# EAGLE design MagusExpander (EAGLE 9.2.1)
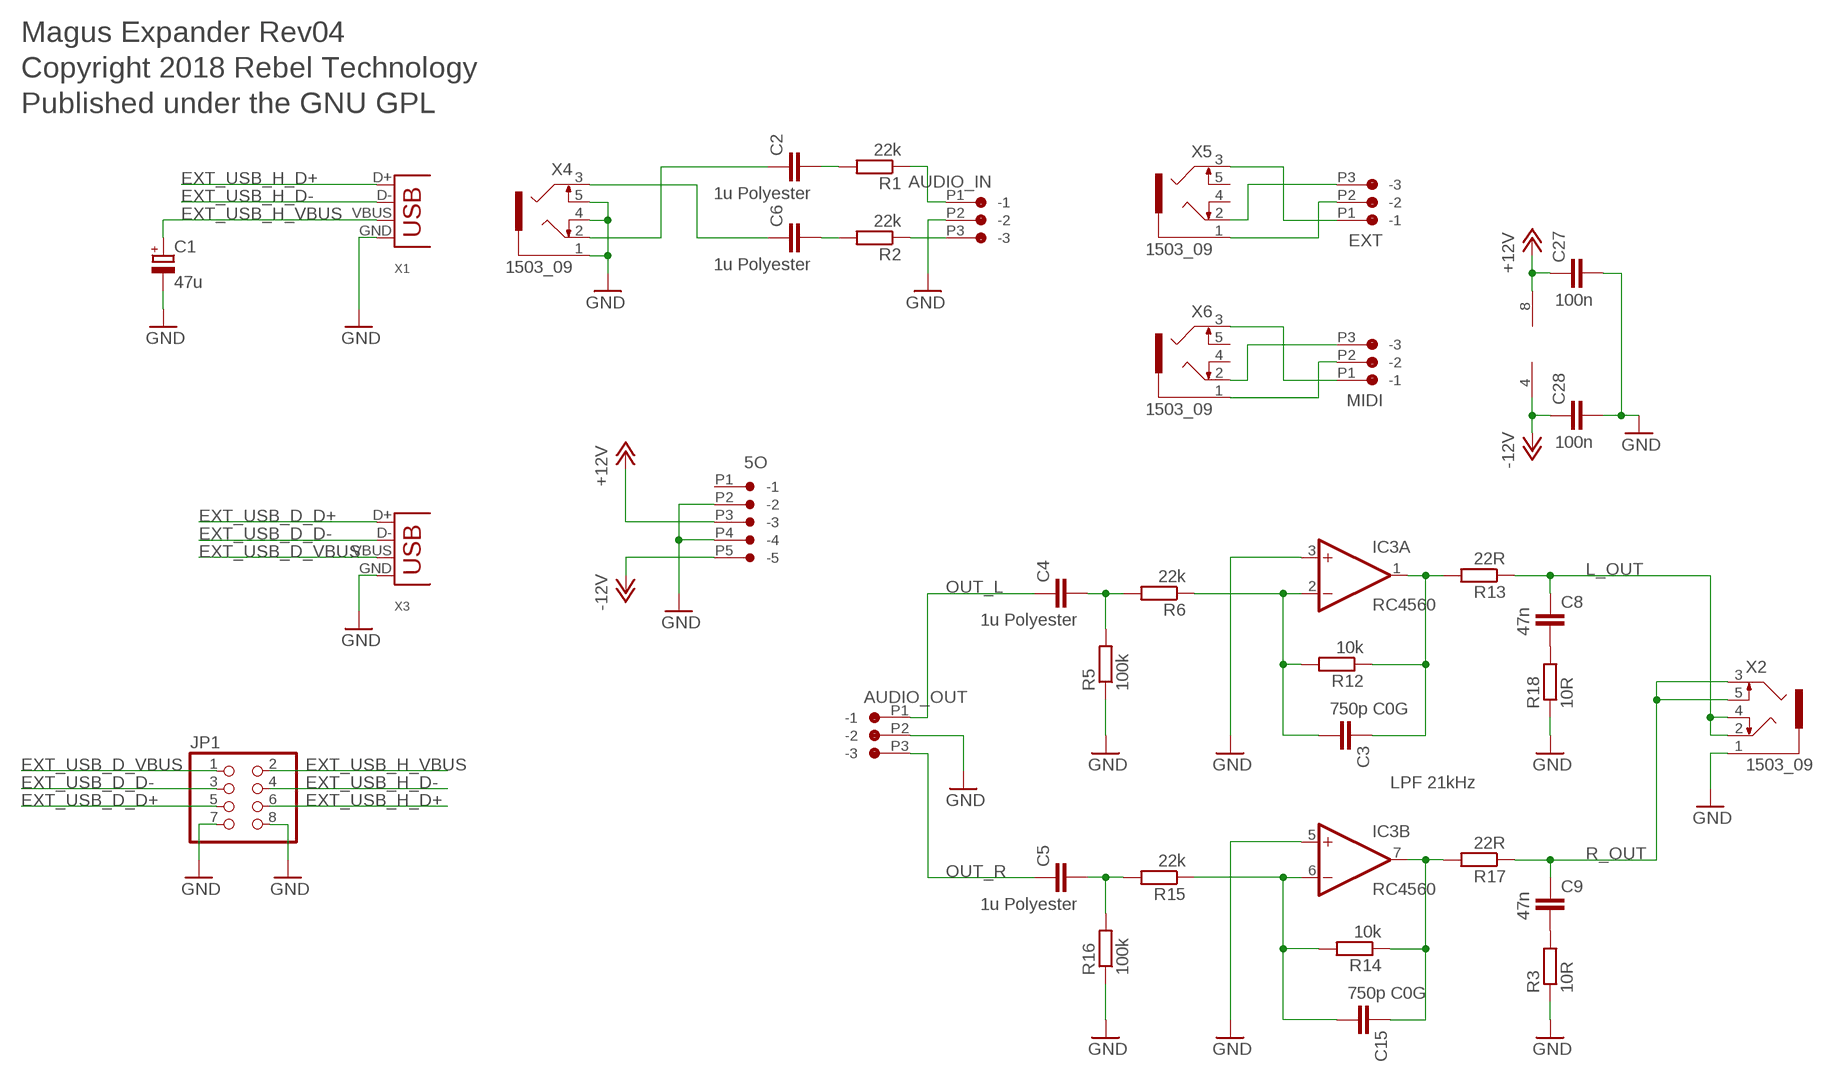
[diagram p0: schematic, sheet 1]

## Parts
5O  CON-JST_PH_5W  [CON-JST_PH_5W]
AUDIO_IN  CON-JST_PH_3W  [CON-JST_PH_3W]
AUDIO_OUT  CON-JST_PH_3W  [CON-JST_PH_3W]
C1  47u  CPOL-EU153CLV-0505  [CPOL-5]
C2  1u Polyester  C-EUC1210  [C1210]
C3  750p C0G  C-EUC0603  [C0603]
C4  1u Polyester  C-EUC1210  [C1210]
C5  1u Polyester  C-EUC1210  [C1210]
C6  1u Polyester  C-EUC1210  [C1210]
C8  47n  C-EUC0603  [C0603]
C9  47n  C-EUC0603  [C0603]
C15  750p C0G  C-EUC0603  [C0603]
C27  100n  C-EUC0603  [C0603]
C28  100n  C-EUC0603  [C0603]
EXT  CON-JST_PH_3W  [CON-JST_PH_3W]
IC3  RC4560  NE5532D  [SO08]
JP1  PINHD-2X4  [2X04]
MIDI  CON-JST_PH_3W  [CON-JST_PH_3W]
R1  22k  R-EU_R0603  [R0603]
R2  22k  R-EU_R0603  [R0603]
R3  10R  R-EU_R0603  [R0603]
R5  100k  R-EU_R0603  [R0603]
R6  22k  R-EU_R0603  [R0603]
R12  10k  R-EU_R0603  [R0603]
R13  22R  R-EU_R0603  [R0603]
R14  10k  R-EU_R0603  [R0603]
R15  22k  R-EU_R0603  [R0603]
R16  100k  R-EU_R0603  [R0603]
R17  22R  R-EU_R0603  [R0603]
R18  10R  R-EU_R0603  [R0603]
X1  USB-A-H  [USB-A-H]
X2  1503_09  [1503_09]
X3  USB-B-H  [USB-B-H]
X4  1503_09  [1503_09]
X5  1503_09  [1503_09]
X6  1503_09  [1503_09]

## Nets
+12V: 5O.P3(-3) C27.1 IC3.8(P:V+)
-12V: 5O.P5(-5) C28.1 IC3.4(P:V-)
EXT_USB_D_D+: JP1.5 X3.D+
EXT_USB_D_D-: JP1.3 X3.D-
EXT_USB_D_VBUS: JP1.1 X3.VBUS
EXT_USB_H_D+: JP1.6 X1.D+
EXT_USB_H_D-: JP1.4 X1.D-
EXT_USB_H_VBUS: C1.+ JP1.2 X1.VBUS
GND: 5O.P2(-2) 5O.P4(-4) AUDIO_IN.P2(-2) AUDIO_OUT.P2(-2) C1.- C27.2 C28.2 IC3.3(A:+IN) IC3.5(B:+IN) JP1.7 JP1.8 R3.1 R5.1 R16.1 R18.1 X1.GND X2.1 X3.GND X4.1 X4.4 X4.5
L_OUT: C8.1 R13.1 X2.2 X2.4
N$1: C15.2 IC3.6(B:-IN) R14.2 R15.1
N$2: C15.1 IC3.7(B:OUT) R14.1 R17.2
N$3: C3.2 IC3.2(A:-IN) R6.1 R12.2
N$4: C5.2 R15.2 R16.2
N$5: AUDIO_IN.P3(-3) R2.1
N$6: AUDIO_IN.P1(-1) R1.1
N$7: MIDI.P1(-1) X6.3
N$8: C4.2 R5.2 R6.2
N$9: C2.1 X4.2
N$10: MIDI.P3(-3) X6.2
N$11: EXT.P1(-1) X5.3
N$12: C9.2 R3.2
N$13: MIDI.P2(-2) X6.1
N$14: EXT.P3(-3) X5.2
N$15: EXT.P2(-2) X5.1
N$17: C6.1 X4.3
N$18: C6.2 R2.2
N$19: C3.1 IC3.1(A:OUT) R12.1 R13.2
N$20: C2.2 R1.2
N$21: C8.2 R18.2
OUT_L: AUDIO_OUT.P1(-1) C4.1
OUT_R: AUDIO_OUT.P3(-3) C5.1
R_OUT: C9.1 R17.1 X2.3 X2.5
Unconnected: 5O.P1(-1) X5.4 X5.5 X6.4 X6.5

## Notes on the sheet
- Magus Expander Rev04
- Copyright 2018 Rebel Technology
- Published under the GNU GPL
- LPF 21kHz

## Library data of the parts
5O = Rebel:CON-JST_PH_5W
AUDIO_IN AUDIO_OUT EXT MIDI = Rebel:CON-JST_PH_3W
C1 = Rebel:CPOL-EU: POLARIZED CAPACITOR, European symbol
C2-C6 C8 C9 C15 C27 C28 = Rebel:C-EU: CAPACITOR, European symbol
IC3 = linear:NE5532: AUDIO AMPLIFIER
JP1 = pinhead:PINHD-2X4: PIN HEADER
R1-R3 R5 R6 R12-R18 = resistor:R-EU_: RESISTOR, European symbol
X1 X3 = con-usb-3:USB: USB Connectors
X2 X4-X6 = con-lumberg:1503_09: Jack connectors according to JISC 6560, 3.5 mm Klinkeneinbaukupplung nach JISC 6560, 3,5 mm, 3-polig/ stereo, abgewinkelte Ausführung, mit 2 Öffnern und Lötaugen, für Leiterplatten Rückseitenmontage Source: http://www.lumberg.com/Produkte/PDFs/1503_09.pdf; OC_FARNELL: 1243244; OC_NEWARK: unknown

## Net classes
1 power: width 0.178 mm, drill 0.305 mm, clearance 0.178 mm to class 0, clearance 0.178 mm

## Board
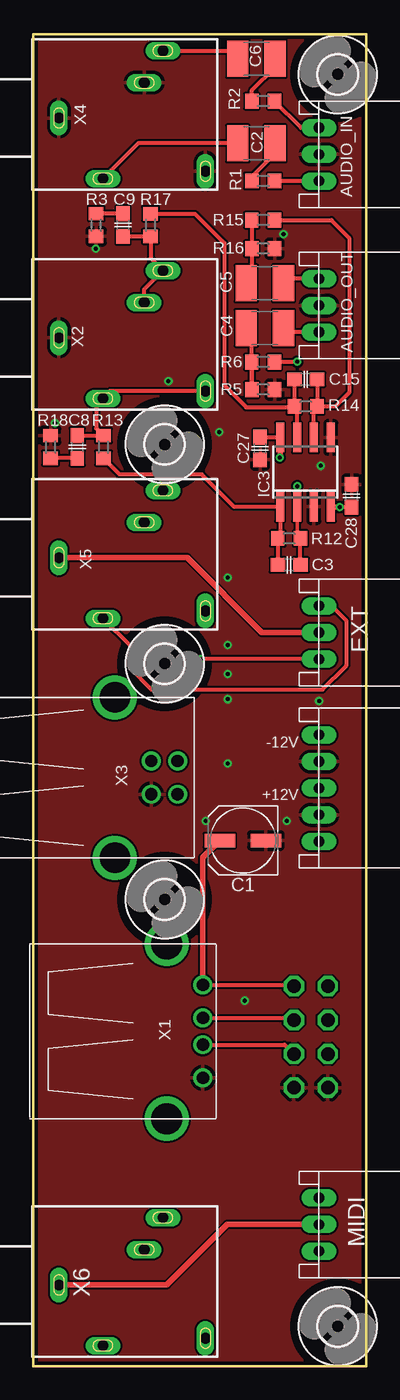
[diagram p1: board, top side]
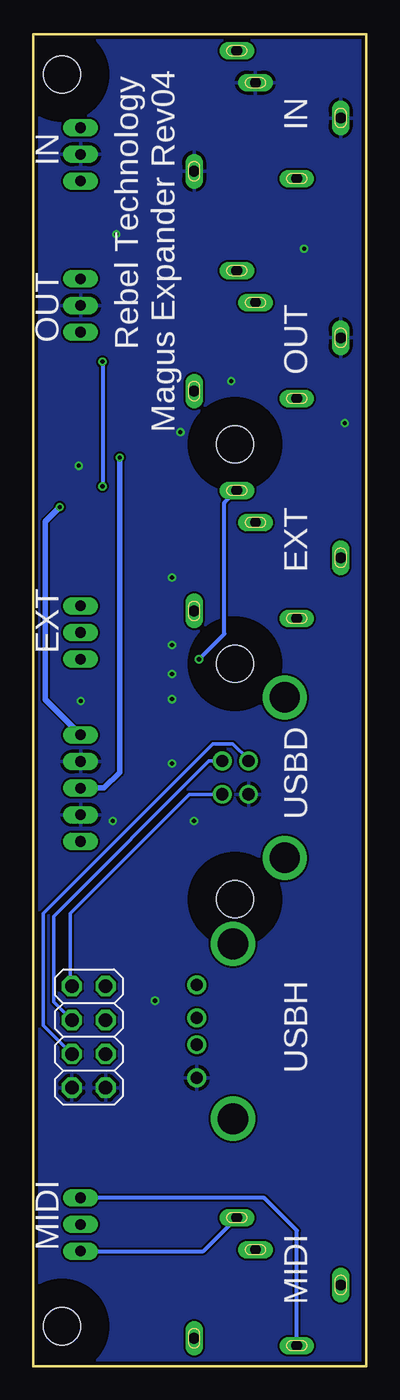
[diagram p2: board, bottom side, seen from below]

Size 25 x 100 mm. Coordinates in mm from the lower left corner, seen from the top.
Outline: 25,100 25,0 0,0 0,100 25,100
Copper layers (1*16): Top 0.035mm / dielectric 1.5mm / Bottom 0.035mm
Design rules "SeeedStudio_2layer_DRU_no_angle_20140221": minimum track width 6mil, minimum drill 12mil, track to track 6mil, track to pad 6mil, pad to pad 6mil, via to via 6mil, smd to smd 0mil, copper to edge 10mil, drill to drill 10mil, minimum pad ring 10mil, minimum via ring 6mil, stop-mask expansion 2mil, vias tented up to drill 100mil, thermal gap 10mil

### Footprints (pad centres in the part's own frame; a part is rotated, then mirrored left to right if it is on the bottom)
CON-JST_PH_5W = drill 0.8 long: P1 0,0; P2 -2,0; P3 -4,0; P4 -6,0; P5 -8,0
CON-JST_PH_3W = drill 0.8 long: P1 0,0; P2 -2,0; P3 -4,0
CPOL-5 = smd 2.3 x 1: + 1.725,0; - -1.725,0
C1210 = smd 1.6 x 2.7: 1 -1.4,0; 2 1.4,0
C0603 = smd 1.1 x 1: 1 -0.85,0; 2 0.85,0
SO08 = smd 0.6 x 2.2: 1 -1.905,-2.6; 2 -0.635,-2.6; 3 0.635,-2.6; 4 1.905,-2.6; 5 1.905,2.6; 6 0.635,2.6; 7 -0.635,2.6; 8 -1.905,2.6
2X04 = drill 1.016 octagon: 1 -3.81,-1.27; 2 -3.81,1.27; 3 -1.27,-1.27; 4 -1.27,1.27; 5 1.27,-1.27; 6 1.27,1.27; 7 3.81,-1.27; 8 3.81,1.27
R0603 = smd 1 x 1.1: 1 -0.85,0; 2 0.85,0
2,8 = hole 2.8: 0,0
USB-A-H = drill 0.914: D+ 2.718,-1.003; D- 2.718,1.003; GND 2.718,-3.493; VBUS 2.718,3.493 | drill 2.311: P$5 0,-6.566; P$6 0,6.566
1503_09 = drill 0.8 pad 1.2 long: 1 0,-2.1; 2 -4.55,-5.4; 3 5.05,-9.9; 4 -4,-13.1; 5 2.65,-8.5
USB-B-H = drill 0.914: D+ 0,1.25; D- 1.981,1.25; GND 0,-1.25; VBUS 1.981,-1.25 | drill 2.286: P$1 -2.718,-6.02; P$2 -2.718,6.02

### Placement (x,y rotation side)
5O  21.45,39.41 270 top
AUDIO_IN  21.45,89 270 top
AUDIO_OUT  21.45,77.65 270 top
C1  15.73,39.47 180 top
C2  16.75,91.83 0 top
C3  19.21,60.17 0 top
C4  17.38,77.95 180 top
C5  17.38,81.32 180 top
C6  16.75,98.17 0 top
C8  3.3,69.03 270 top
C9  6.73,85.69 90 top
C15  20.45,74.1 0 top
C27  17.02,68.92 270 top
C28  23.89,65.36 90 top
EXT  21.45,53.09 270 top
IC3  20.43,67.14 0 top
JP1  20.84,24.72 270 bottom
MIDI  21.45,8.64 270 top
R1  17.25,89 180 top
R2  17.25,94.99 180 top
R3  4.72,85.69 90 top
R5  17.25,73.33 180 top
R6  17.25,75.4 180 top
R12  19.21,62.16 0 top
R13  5.27,69.03 270 top
R14  20.45,72.07 0 top
R15  17.25,86.06 180 top
R16  17.25,83.92 180 top
R17  8.8,85.68 90 top
R18  1.29,69.03 270 top
U$1  [2,8]  22.86,3 90 top
U$2  [2,8]  9.86,69.22 90 top
U$3  [2,8]  9.86,35.06 90 top
U$4  [2,8]  9.86,52.75 90 top
U$5  [2,8]  22.86,97 90 top
X1  10.02,25.15 0 top
X2  -0.17,77.22 90 top
X3  8.85,44.2 0 top
X4  -0.17,93.73 90 top
X5  -0.17,60.71 90 top
X6  -0.17,6.1 90 top

### Tracks (layer width: path | path; a pad name or v marks a point on that pad's centre or on a via)
+12V  (via drill 0.3)
  Top 0.254: 18.52,68.24 v18.5,68.22
  Top 0.305: IC3.8 17.05,69.74 C27.1
  Top 0.406: IC3.8 18.52,68.24
  Bottom 0.406: v18.5,68.22 18.5,49.38 18.5,44.6 19.7,43.41 5O.P3
-12V  (via drill 0.3)
  Top 0.254: C28.1 v23,64.51 v23,64.52 | 22.36,64.51 IC3.4
  Top 0.406: 22.36,64.51 v23,64.51
  Bottom 0.406: v23,64.52 24.1,63.43 24.1,51.22 24.1,50.06 5O.P5
EXT_USB_D_D+
  Bottom 0.254: X3.D+ 8.85,45.57 10.02,46.74 11.52,46.74 24.25,34.02 24.25,25.59 JP1.5
EXT_USB_D_D-
  Bottom 0.254: JP1.3 23.48,27.36 23.48,33.79 11.81,45.45 X3.D-
EXT_USB_D_VBUS
  Bottom 0.254: JP1.1 22.23,28.66 22.23,34.01 13.3,42.95 X3.VBUS
EXT_USB_H_D+
  Top 0.305: X1.D+ 18.87,24.15 JP1.6
EXT_USB_H_D-
  Top 0.305: X1.D- 19.4,26.15 JP1.4
EXT_USB_H_VBUS
  Top 0.305: X1.VBUS 19.45,28.64 JP1.2
  Top 0.406: C1.+ 12.73,38.2 X1.VBUS
GND  (via drill 0.3)
  other vias: 19.04,40.94 15.87,27.45 21.45,49.96 14.59,50.09 21.57,67.61 13.96,70.15 10.14,73.96 18.78,85.01 1.63,70.83 4.68,83.91 14.59,51.99 14.59,54.15 14.59,59.23 12.94,40.94 14.59,45.26
  pour Top: 26.48,-7.06 -4.94,-7.06 -4.94,100.75 26.48,100.75
  pour Bottom: 26.75,-7.33 -4.94,-7.33 -4.94,101.75 26.75,101.75
L_OUT
  Top 0.305: C8.1 R13.1 4.72,70.43 4.72,72.16 X2.2 5.78,73.22 X2.4
N$1
  Top 0.305: R15.1 22.37,86.06 23.71,84.72 23.71,73.12 22.65,72.07 R14.2 | IC3.6 21.06,71.84 R14.2 | C15.2 R14.2
N$2
  Top 0.305: IC3.7 19.79,71.87 R14.1 | C15.1 R14.1 | R17.2 12.13,86.53 14.33,84.33 14.33,73.66 15.98,72.01 19.54,72.01 R14.1
N$3  (via drill 0.3)
  Top 0.254: R6.1 18.17,75.42 | R12.2 arc-90 19.8,62.41 19.8,64.53 IC3.2 v19.8,66.07
  Top 0.305: 18.17,75.42 v19.8,75.42 | C3.2 R12.2
  Bottom 0.305: v19.8,75.42 v19.8,66.07
N$4
  Top 0.305: R15.2 R16.2 16.41,80.72 16.3,80.62 16.3,81.15 C5.2
N$5
  Top 0.305: AUDIO_IN.P3 20.1,93 R2.1
N$6
  Top 0.305: AUDIO_IN.P1 R1.1
N$7
  Bottom 0.305: MIDI.P1 12.24,8.64 X6.3
N$8
  Top 0.305: R6.2 16.4,75.31 16.39,75.3 R5.2 16.41,77.68 C4.2
N$9
  Top 0.305: C2.1 7.87,91.83 X4.2
N$10
  Bottom 0.305: MIDI.P3 7.67,12.64 5.23,10.2 X6.2
N$11  (via drill 0.35)
  Top 0.305: EXT.P1 v12.55,53.09
  Bottom 0.305: X5.3 10.65,64.83 10.65,54.99 v12.55,53.09
N$12
  Top 0.305: C9.2 R3.2
N$13
  Top 0.406: X6.1 10.02,6.1 14.55,10.64 MIDI.P2
N$14
  Top 0.305: X5.2 7.22,54.16 7.22,52.45 8.87,50.8 21.7,50.8 23.48,52.58 23.48,56.01 22.4,57.09 EXT.P3
N$15
  Top 0.406: EXT.P2 17.16,55.09 11.54,60.71 X5.1
N$17
  Top 0.305: X4.3 14.74,98.78 C6.1
N$18
  Top 0.305: C6.2 18.15,97.54 16.4,95.8 R2.2
N$19
  Top 0.254: 18.51,64.52 IC3.1
  Top 0.305: IC3.1 18.52,62.43 R12.1 C3.1 | 18.51,64.52 15.09,64.52 12.65,66.96 6.49,66.96 R13.2
N$20
  Top 0.305: R1.2 16.4,89.32 17.76,90.68 17.76,91.44 C2.2
N$21
  Top 0.305: C8.2 R18.2
OUT_L
  Top 0.305: AUDIO_OUT.P1 19.23,77.65 C4.1
OUT_R
  Top 0.305: AUDIO_OUT.P3 19.27,81.65 C5.1
R_OUT
  Top 0.305: C9.1 R17.1 8.8,83.19 X2.3 8.33,80.87 X2.5

### Text on the board
tPlace: -12V | +12V
bPlace: Magus Expander Rev04 | Rebel Technology | IN | IN | OUT | OUT | EXT | EXT | USBD | USBH | MIDI | MIDI